# Altium schematic sheet 05021002_Analog's.SchDoc: Ipê Board
size A4; Organization: Cerebra SC; Address1: R. Coriolano José Gilbertone; Address2: Jd. Paulista; Address3: n° 703; Address4: São Carlos - Brasil; DocumentNumber: 5; Revision: A; SheetNumber: 5; SheetTotal: 8
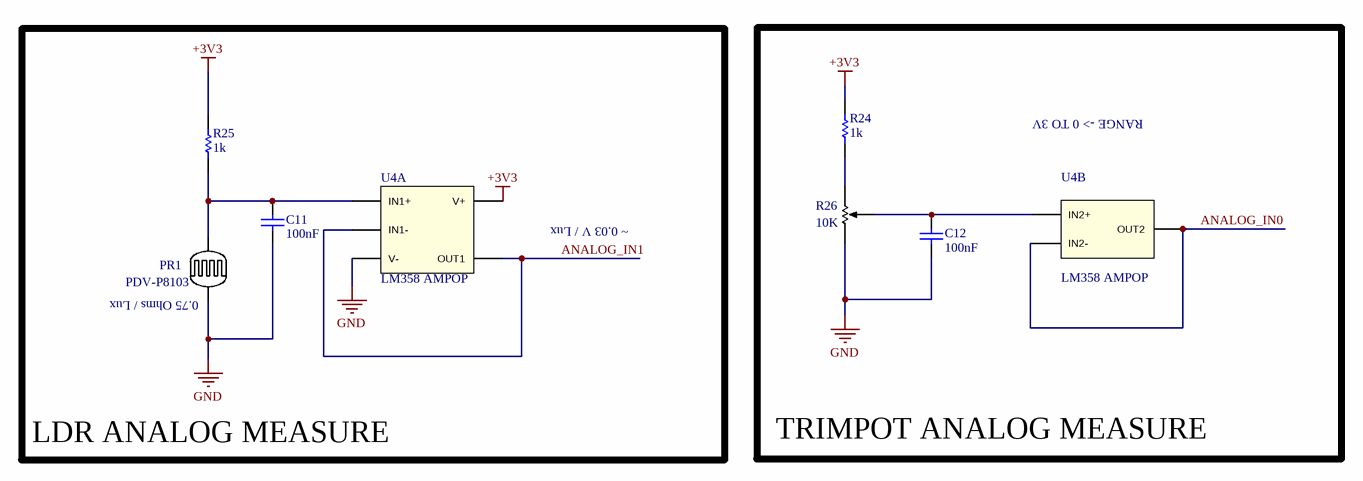
[diagram p0: 05021002_Analog's.SchDoc]

## Parts
C11  100nF  [CAPC2012X135N]
C12  100nF  [CAPC2012X135N]
PR1  PDV-P8103  [PDV-P8103]
R24  1k  [0805]
R25  1k  [0805]
R26  10K  [TC33X-2-103E]
U4  LM358 AMPOP  [SOIC 8]  (parts A,B of 2)

## Blocks framed on the sheet
LDR ANALOG MEASURE: C11 PR1 R25 U4
TRIMPOT ANALOG MEASURE: C12 R24 R26 U4

## Nets
+3V3: R24.2 R25.2 U4.8(V+)
GND: C11.1 C12.1 PR1.2 R26.1(CCW) U4.4(V-)
ANALOG_IN0: U4.6(IN2-) U4.7(OUT2)
ANALOG_IN1: U4.1(OUT1) U4.2(IN1-)
NetC11_2: C11.2 PR1.1 R25.1 U4.3(IN1+)
NetC12_2: C12.2 R26.2(WIPER) U4.5(IN2+)
NetR24_1: R24.1 R26.3(CW)

## Notes on the sheet
- RANGE -> 0 TO 3V
- ~ 0.03 V / Lux
- (near PR1) 0.75 Ohms / Lux
- Title
- Size:
- Date:
- A4
- Number:
- Time:
- Revision:
- Sheet
- of
- File:

## Library data of the parts
C11 C12 = capacitor_gen: Generic Capacitor; Part Number 1: 885012207016; Manufacturer 1: Wurth Electronics Inc; Value: 100nF
PR1 = PhotoResistor PDV-P8103: Photoconductive photocells designed to sense light from 400 to 700 nm; Manufacturer 1: Luna Optoelectronics; Part Number 1: PDV-P8103
R24 R25 = resistor_gen: Part Number 1: RC0805JR-071KL; Manufacturer 1: Yageo; Value: 1k
R26 = Trimmer 10K: 3 mm SMD Trimpot® Trimming Potentiometer; Bourns: Manufacturer 1; Part Number 1: TC33X-2-103E
U4 = LM358: OPERATIONAL AMPLIFIER LM358; Part Number 1: LM358DR; Manufacturer 1: Texas Instruments